# EAGLE design v03 (EAGLE 6.6.0)
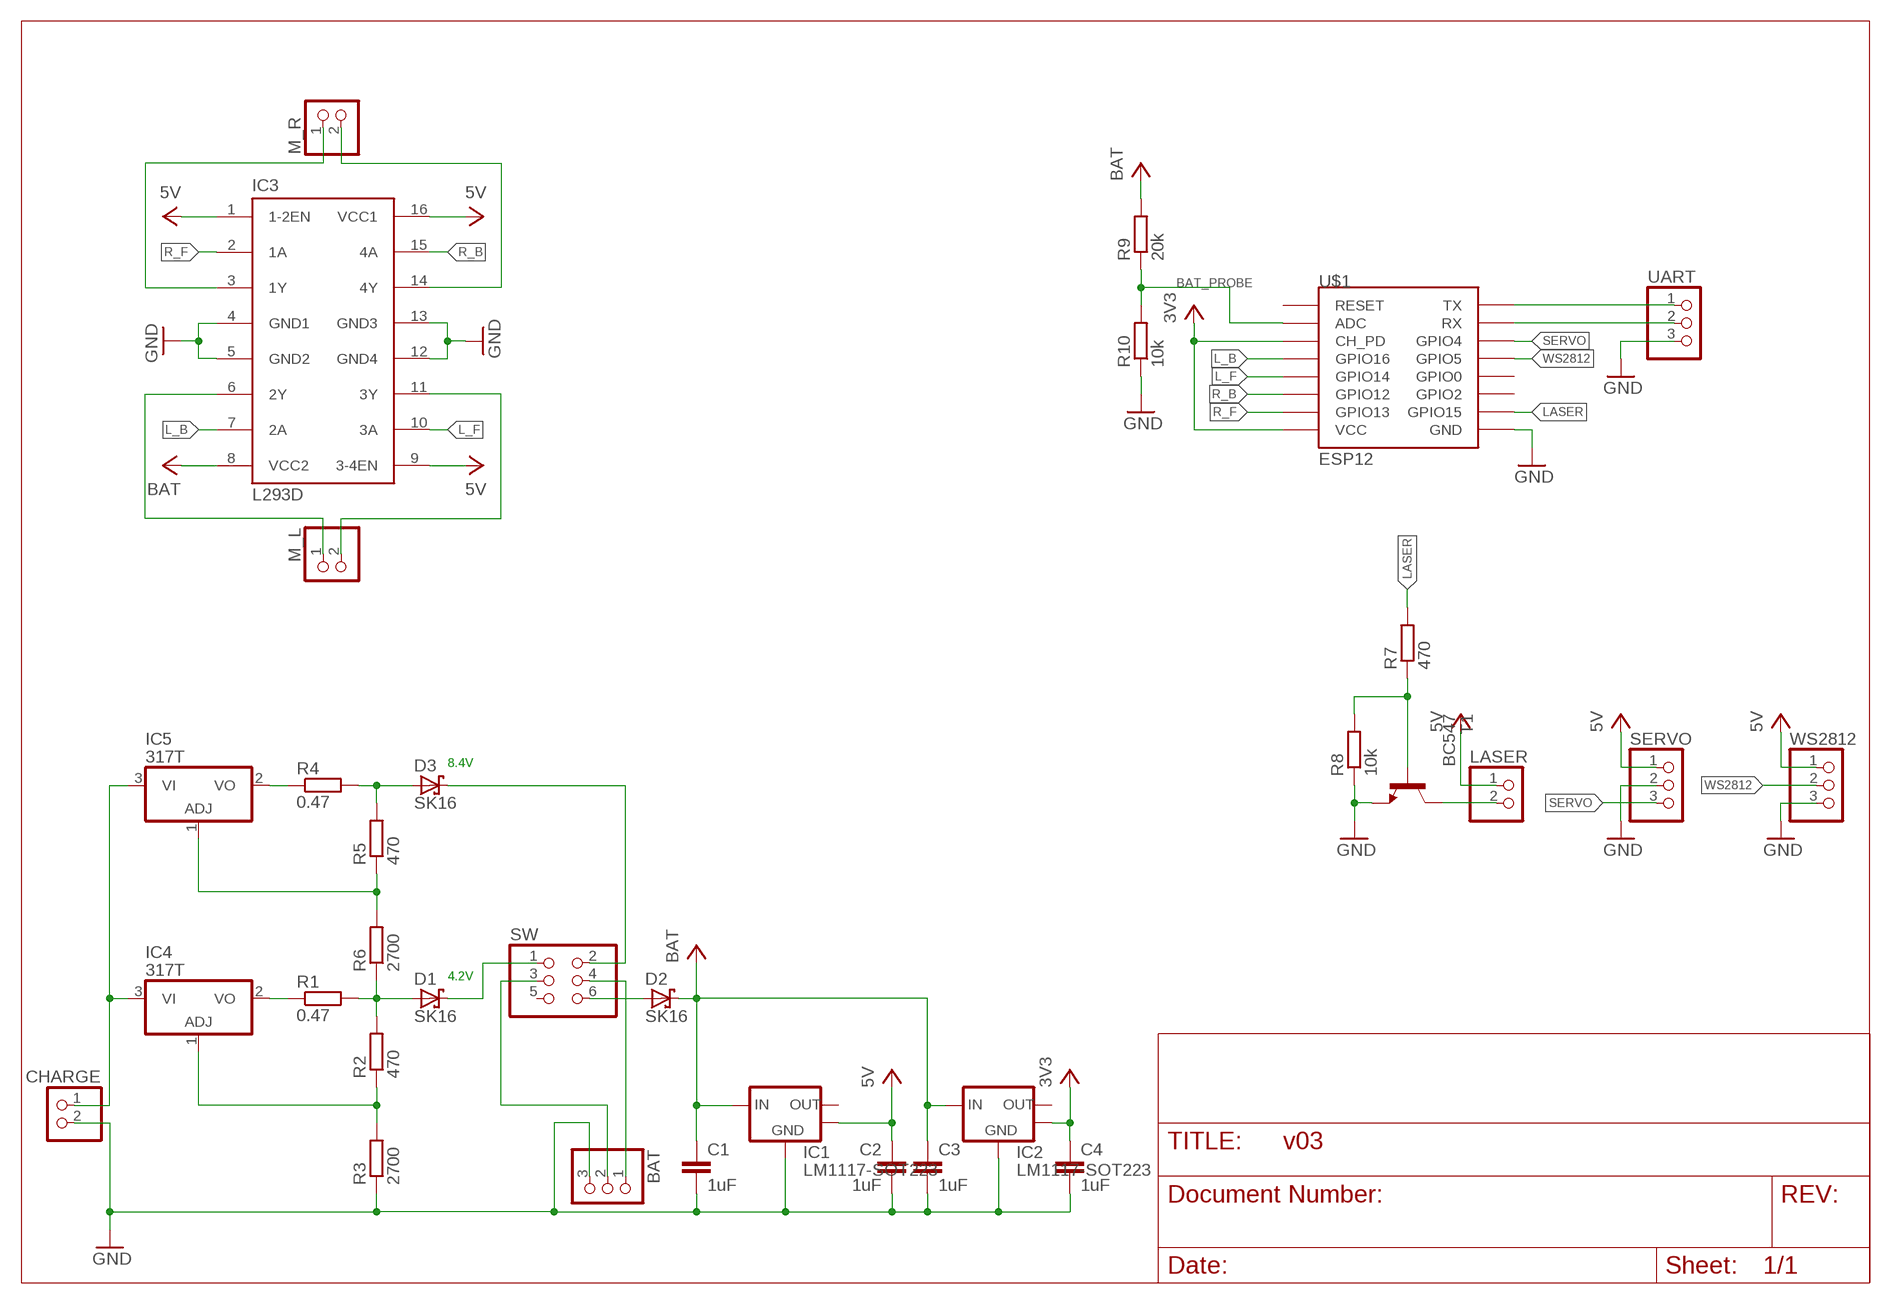
[diagram p0: schematic, sheet 1]

## Parts
BAT  PINHD-1X3  [1X03]
C1  1uF  C-EUC0805  [C0805]
C2  1uF  C-EUC0805  [C0805]
C3  1uF  C-EUC0805  [C0805]
C4  1uF  C-EUC0805  [C0805]
CHARGE  PINHD-1X2  [1X02]
D1  SK16  SCHOTTKY-DIODESMD  [SMB]
D2  SK16  SCHOTTKY-DIODESMD  [SMB]
D3  SK16  SCHOTTKY-DIODESMD  [SMB]
IC1  LM1117-SOT223  [SOT-223-3]
IC2  LM1117-SOT223  [SOT-223-3]
IC3  L293D  [DIL16]
IC4  317T  [TO220H]
IC5  317T  [TO220H]
LASER  PINHD-1X2  [1X02]
M_L  PINHD-1X2  [1X02]
M_R  PINHD-1X2  [1X02]
R1  0.47  R-EU_MELF0207W  [MINI_MELF-0207W]
R2  470  R-EU_R0805  [R0805]
R3  2700  R-EU_R0805  [R0805]
R4  0.47  R-EU_MELF0207W  [MINI_MELF-0207W]
R5  470  R-EU_R0805  [R0805]
R6  2700  R-EU_R0805  [R0805]
R7  470  R-EU_R0805  [R0805]
R8  10k  R-EU_R0805  [R0805]
R9  20k  R-EU_R0805  [R0805]
R10  10k  R-EU_R0805  [R0805]
SERVO  PINHD-1X3  [1X03]
SW  PINHD-2X3  [2X03]
T1  BC547  [TO92]
U$1  ESP12  [ESP12]
UART  PINHD-1X3  [1X03]
WS2812  PINHD-1X3  [1X03]

## Nets
3V3: C4.1 IC2.4(HEATSINK) U$1.CH_PD U$1.VCC
5V: C2.1 IC1.4(HEATSINK) IC3.1(1-2EN) IC3.9(3-4EN) IC3.16(VCC1) LASER.1 SERVO.1 WS2812.1
BAT: C1.1 C3.1 D2.C IC1.3(VIN) IC2.3(VIN) IC3.8(VCC2) R9.2
BAT_PROBE: R9.1 R10.2 U$1.ADC
GND: BAT.3 C1.2 C2.2 C3.2 C4.2 CHARGE.2 IC1.1(GND) IC2.1(GND) IC3.4(GND1) IC3.5(GND2) IC3.12(GND4) IC3.13(GND3) R3.1 R8.1 R10.1 SERVO.2 T1.1(E) U$1.GND UART.3 WS2812.3
L_B: IC3.7(2A) U$1.GPIO16
L_F: IC3.10(3A) U$1.GPIO14
LASER: R7.2 U$1.GPIO15
N$1: BAT.1 SW.4
N$3: CHARGE.1 IC4.3(VI) IC5.3(VI)
N$4: BAT.2 SW.3
N$5: IC3.3(1Y) M_R.1
N$6: IC3.14(4Y) M_R.2
N$7: IC3.6(2Y) M_L.1
N$8: IC3.11(3Y) M_L.2
N$9: U$1.TX UART.1
N$10: U$1.RX UART.2
N$11: LASER.2 T1.3(C)
N$12: D1.A R1.2 R2.2 R6.1
N$13: IC4.1(ADJ) R2.1 R3.2
N$14: IC4.2(VO) R1.1
N$16: D1.C SW.1
N$17: IC5.1(ADJ) R5.1 R6.2
N$18: IC5.2(VO) R4.1
N$19: D3.C SW.2
N$20: D3.A R4.2 R5.2
N$21: D2.A SW.6
R8: R7.1 R8.2 T1.2(B)
R_B: IC3.15(4A) U$1.GPIO12
R_F: IC3.2(1A) U$1.GPIO13
SERVO: SERVO.3 U$1.GPIO4
WS2812: U$1.GPIO5 WS2812.2
Unconnected: IC1.2(VOUT) IC2.2(VOUT) SW.5 U$1.GPIO0 U$1.GPIO2 U$1.RESET

## Notes on the sheet
- 8.4V
- 4.2V

## Library data of the parts
BAT SERVO UART WS2812 = pinhead:PINHD-1X3: PIN HEADER
C1-C4 = rcl:C-EU: CAPACITOR, European symbol
CHARGE LASER M_L M_R = pinhead:PINHD-1X2: PIN HEADER
D1-D3 = diode:SCHOTTKY-DIODE: Schottky Diode
IC1 IC2 = voltage_regulator:LM1117: LDO Voltage Regulator NCP1117 series are low dropout positive voltage regulators that are capable of providing an output current that is in excess of 1.0 A with a maximum dropout voltage of 1.2 V at 800 mA over temperature. This series contains nine fixed output voltages of 1.5 V, 1.8 V, 1.9 V, 2.0 V, 2.5 V, 2.85 V, 3.3 V, 5.0 V, and 12 V that have no minimum load requirement to maintain regulation. Also included is an adjustable output version that can be programmed from 1.25 V to 18.8 V with two external resistors. datasheet.pdf <http://www.onsemi.com/pub_link/Collateral/NCP1117-D.PDF> LM1117-N is a series of low dropout voltage regulators of 1.2V at 800mA of load current. It has the same pin-out as Texas Instruments' industry standard LM317. The LM1117-N is available in an adjustable version, available in five fixed voltages, 1.8V, 2.5V, 2.85V, 3.3V, and 5V. The LM1117-N offers current limiting and thermal shutdown. Its circuit includes a zener trimmed to within ±1%. datasheet.pdf <http://www.ti.com/lit/ds/symlink/lm1117-n.pdf>
IC3 = st-microelectronics:L293D: PUSH-PULL 4 CHANNEL DRIVER; MPN: L293D; OC_FARNELL: 9589619; OC_NEWARK: 56P8249
IC4 IC5 = linear:*317: Positive VOLTAGE REGULATOR
R1 R4 = resistor:R-EU_: RESISTOR, European symbol
R2 R3 R5-R10 = rcl:R-EU_: RESISTOR, European symbol
SW = pinhead:PINHD-2X3: PIN HEADER
T1 = transistor:BC547: NPN TRANSISTOR
U$1 = esp8266modules:ESP12: ESP8266 Wifi module 12

## Board
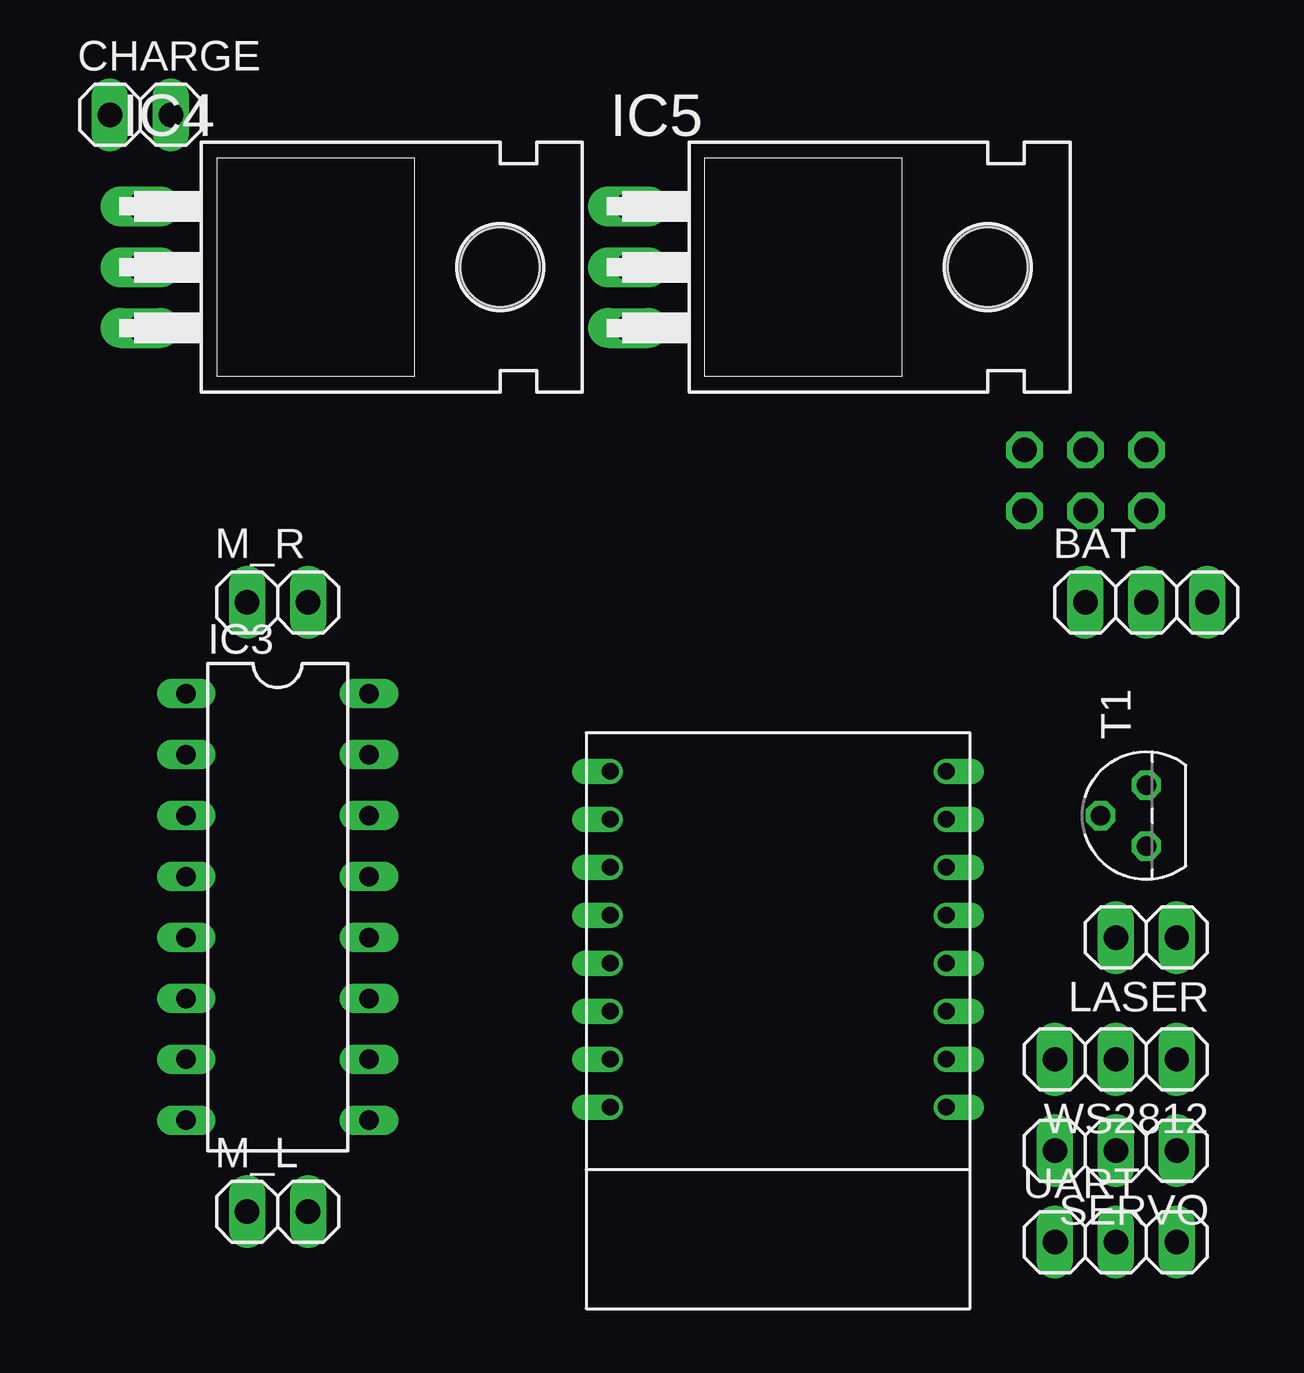
[diagram p1: board, top side]
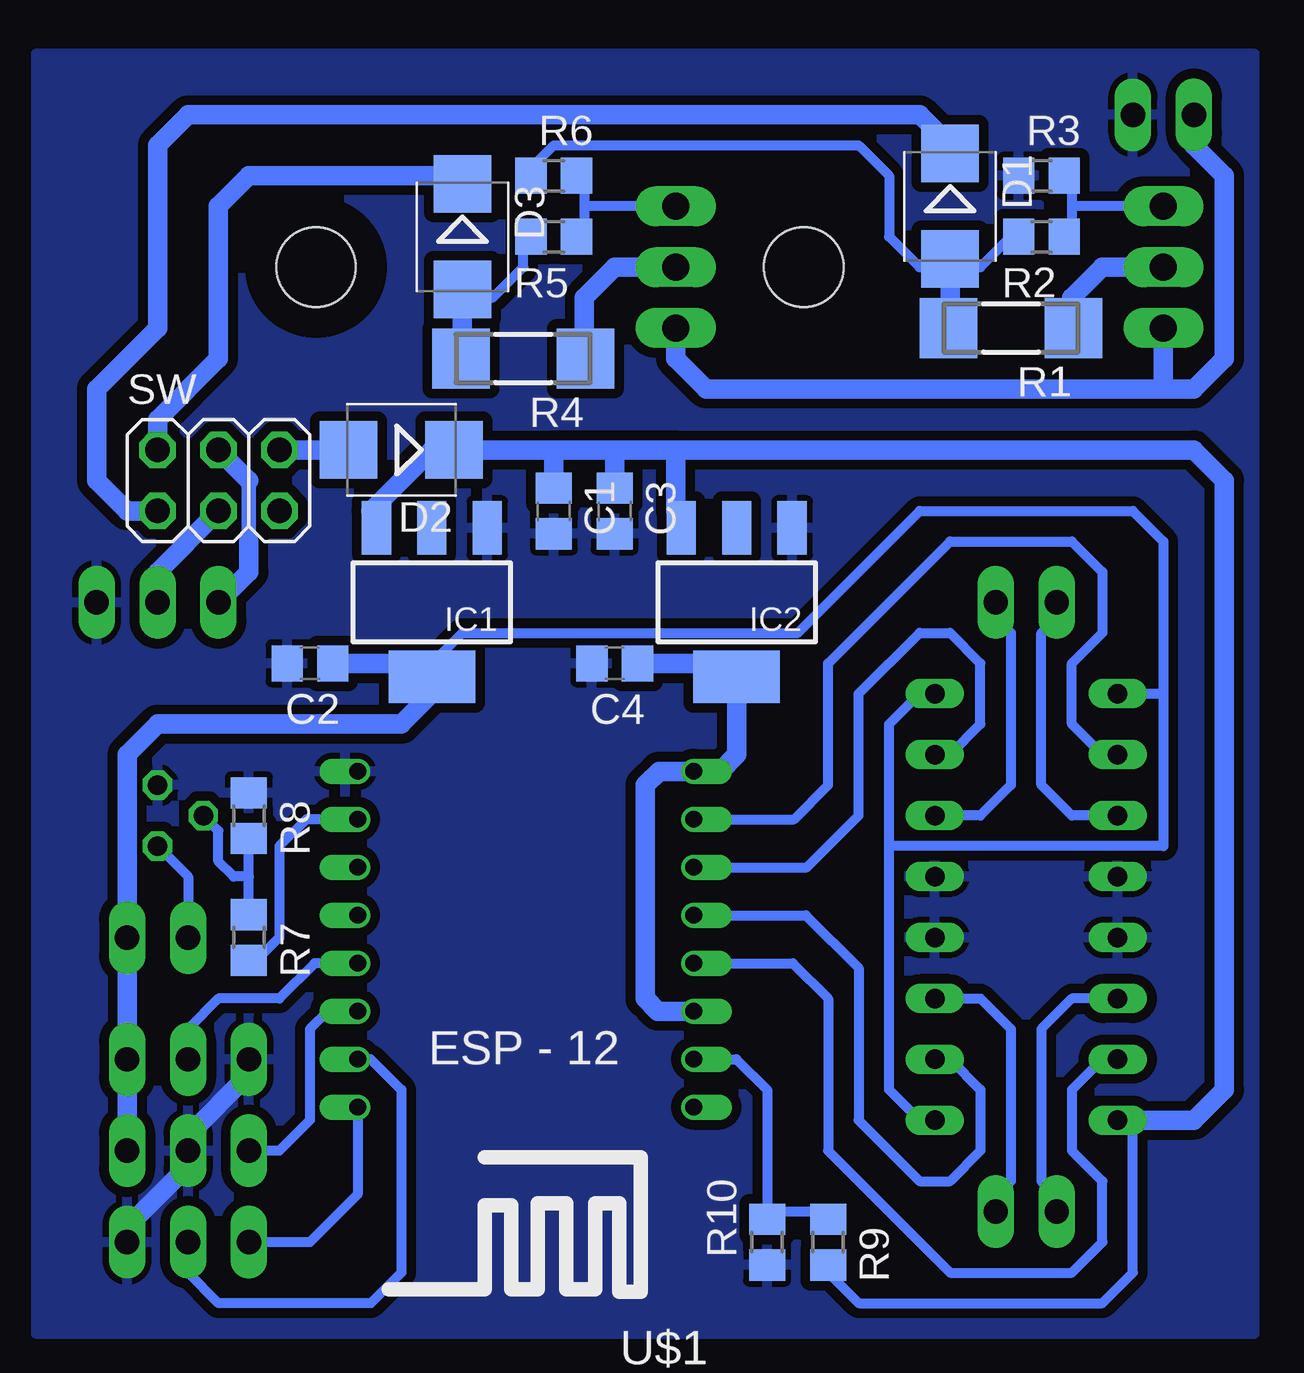
[diagram p2: board, bottom side, seen from below]

No outline drawn. Coordinates in mm, seen from the top.
Copper layers (1*16): Top 0.0356mm / dielectric 1.5011mm / Bottom 0.0356mm
Design rules "LaenPCBOrder": minimum track width 6mil, minimum drill 13mil, track to track 6mil, track to pad 6mil, pad to pad 6mil, via to via 6mil, smd to smd 6mil, copper to edge 15mil, drill to drill 6mil, minimum pad ring 7mil, minimum via ring 7mil, stop-mask expansion 3mil, vias tented up to drill 0mil, thermal gap 10mil

### Footprints (pad centres in the part's own frame; a part is rotated, then mirrored left to right if it is on the bottom)
1X03 = drill 1.016 long: 1 -2.54,0; 2 0,0; 3 2.54,0
C0805 = smd 1.3 x 1.5: 1 -0.95,0; 2 0.95,0
1X02 = drill 1.016 long: 1 -1.27,0; 2 1.27,0
SMB = smd 2.4 x 2.4: A 2.2,0; C -2.2,0
SOT-223-3 = smd 1.219 x 2.235: 1 -2.311,-3.099; 2 0,-3.099; 3 2.311,-3.099 | smd 3.6 x 2.2: 4 0,3.099
DIL16 = drill 0.813 long: 1 -8.89,-3.81; 2 -6.35,-3.81; 3 -3.81,-3.81; 4 -1.27,-3.81; 5 1.27,-3.81; 6 3.81,-3.81; 7 6.35,-3.81; 8 8.89,-3.81; 9 8.89,3.81; 10 6.35,3.81; 11 3.81,3.81; 12 1.27,3.81; 13 -1.27,3.81; 14 -3.81,3.81; 15 -6.35,3.81; 16 -8.89,3.81
TO220H = drill 1.118 long: 1 -2.54,-10.16; 2 0,-10.16; 3 2.54,-10.16 | hole 3.302: 0,4.826
MINI_MELF-0207W = smd 2.4 x 2.5: 1 -2.6,0; 2 2.6,0
R0805 = smd 1.3 x 1.5: 1 -0.95,0; 2 0.95,0
2X03 = drill 1.016 octagon: 1 -2.54,-1.27; 2 -2.54,1.27; 3 0,-1.27; 4 0,1.27; 5 2.54,-1.27; 6 2.54,1.27
TO92 = drill 0.813 octagon: 1 1.27,0; 2 0,1.905; 3 -1.27,0
ESP12 = drill 0.7 offset: ADC -7.1,3.8; CH_PD -7.1,1.8; GND 6.9,-8.2; GPIO0 6.9,-2.2; GPIO2 6.9,-4.2; GPIO4 6.9,1.8; GPIO5 6.9,-0.2; GPIO12 -7.1,-4.2; GPIO13 -7.1,-6.2; GPIO14 -7.1,-2.2; GPIO15 6.9,-6.2; GPIO16 -7.1,-0.2; RESET -7.1,5.8; RX 6.9,3.8; TX 6.9,5.8; VCC -7.1,-8.2

### Placement (x,y rotation side)
BAT  45.72,30.48 0 top
C1  29.21,34.29 270 bottom
C2  39.37,27.94 180 bottom
C3  26.67,34.29 270 bottom
C4  26.67,27.94 180 bottom
CHARGE  3.81,50.8 0 top
D1  12.7,46.99 270 bottom
D2  35.56,36.83 180 bottom
D3  33.02,45.72 270 bottom
IC1  34.29,30.48 180 bottom
IC2  21.59,30.48 180 bottom
IC3  9.53,17.78 270 top
IC4  13.97,44.45 270 top
IC5  34.29,44.45 270 top
LASER  45.72,16.51 180 top
M_L  9.53,5.08 0 top
M_R  9.53,30.48 0 top
R1  10.16,41.91 180 bottom
R2  8.89,45.72 180 bottom
R3  8.89,48.26 0 bottom
R4  30.48,40.64 180 bottom
R5  29.21,45.72 180 bottom
R6  29.21,48.26 0 bottom
R7  41.91,16.51 270 bottom
R8  41.91,21.59 270 bottom
R9  17.78,3.81 270 bottom
R10  20.32,3.81 90 bottom
SERVO  44.45,7.62 180 top
SW  43.18,35.56 0 bottom
T1  45.72,21.59 90 top
U$1  30.48,15.24 180 bottom
UART  44.45,3.81 0 top
WS2812  44.45,11.43 180 top

### Tracks (layer width: path | path; a pad name or v marks a point on that pad's centre or on a via)
3V3
  Bottom 0.813: 21.59,26.67 21.59,24.13 22.28,23.44 U$1.VCC 24.82,23.44 25.4,22.86 25.4,13.97 24.87,13.44 U$1.CH_PD | 21.59,26.67 IC2.4 | C4.1 22.86,27.94 21.59,26.67
5V
  Bottom 0.406: 15.24,20.32 3.81,20.32 3.81,26.67 | 15.24,20.32 15.24,25.4 13.97,26.67 IC3.16 | IC3.9 13.97,8.89 15.24,10.16 15.24,20.32 | 3.81,26.67 3.81,33.02 5.08,34.29 13.97,34.29 19.05,29.21 33.02,29.21 34.29,27.94 IC1.4 | IC3.1 3.81,26.67
  Bottom 0.813: SERVO.1 WS2812.1 LASER.1 46.99,24.13 45.72,25.4 35.56,25.4 34.29,26.67 34.29,27.94 C2.1
BAT
  Bottom 0.406: R9.2 17.78,2.54 16.51,1.27 6.35,1.27 5.08,2.54 5.08,8.89 2.54,8.89
  Bottom 0.813: 24.13,36.83 2.54,36.83 1.27,35.56 1.27,10.16 2.54,8.89 IC3.8 | IC2.3 23.9,34.06 24.13,34.29 24.13,36.83 | 29.21,36.83 D2.C 34.29,36.83 36.83,34.29 36.6,34.06 IC1.3 | 26.67,36.83 29.21,36.83 | C3.1 26.67,36.83 | C1.1 29.21,36.83 | 24.13,36.83 26.67,36.83
BAT_PROBE
  Bottom 0.406: R9.1 17.78,5.08 20.32,5.08 | U$1.ADC 21.6,11.44 20.32,10.16 20.32,5.08 | 20.32,5.08 R10.2
GND
  Bottom 0.813: UART.3 46.99,4.45 44.45,6.99 SERVO.2 44.45,8.26 41.91,10.79 WS2812.3
  pour Bottom (isolate 0.406): 0,0 0,53.34 50.8,53.34 50.8,0
L_B
  Bottom 0.406: IC3.7 6.35,11.43 7.62,10.16 7.62,7.62 6.35,6.35 6.35,3.81 7.62,2.54 12.7,2.54 17.78,7.62 17.78,13.97 19.25,15.44 U$1.GPIO16
L_F
  Bottom 0.406: IC3.10 12.7,11.43 11.43,10.16 11.43,7.62 12.7,6.35 13.97,6.35 16.51,8.89 16.51,15.24 18.71,17.44 U$1.GPIO14
LASER
  Bottom 0.406: U$1.GPIO15 39.52,21.44 40.64,20.32 40.64,16.51 41.91,15.24 R7.2
N$1
  Bottom 0.61: 41.91,33.02 41.91,35.56
  Bottom 0.813: BAT.1 41.91,31.75 41.91,33.02 | 41.91,35.56 SW.4
N$3
  Bottom 0.813: CHARGE.1 2.54,49.53 1.27,48.26 1.27,40.64 2.54,39.37 3.81,39.37 | IC4.3 3.81,39.37 | 3.81,39.37 22.86,39.37 24.13,40.64 IC5.3
N$4
  Bottom 0.813: BAT.2 45.72,31.75 SW.3
N$5
  Bottom 0.406: IC3.3 7.62,21.59 8.89,22.86 8.89,29.21 8.26,29.84 M_R.1
N$6
  Bottom 0.406: M_R.2 10.79,29.84 10.16,29.21 10.16,22.86 11.43,21.59 IC3.14
N$7
  Bottom 0.406: IC3.6 7.62,13.97 8.89,12.7 8.89,6.35 8.26,5.71 M_L.1
N$8
  Bottom 0.406: IC3.11 11.43,13.97 10.16,12.7 10.16,6.35 10.79,5.71 M_L.2
N$9
  Bottom 0.406: UART.1 39.37,3.81 37.38,5.8 U$1.TX
N$10
  Bottom 0.406: U$1.RX 36.84,11.44 35.56,10.16 35.56,2.54 36.83,1.27 43.18,1.27 44.45,2.54 UART.2
N$11
  Bottom 0.406: T1.3 44.45,19.05 LASER.2
N$12
  Bottom 0.406: R2.2 10.16,45.72 11.43,44.45 12.7,44.45 13.97,44.45 15.24,45.72 15.24,48.26 16.51,49.53 29.21,49.53 30.48,48.26 R6.1
  Bottom 0.813: R1.2 12.7,41.91 12.7,44.45 D1.A
N$13
  Bottom 0.406: IC4.1 7.62,46.99 | 7.62,46.99 7.62,45.72 R2.1 | R3.2 7.62,48.26 7.62,46.99
N$14
  Bottom 0.813: R1.1 7.62,41.91 7.62,43.18 6.35,44.45 IC4.2
N$16
  Bottom 0.813: D1.C 12.7,49.53 13.97,50.8 44.45,50.8 45.72,49.53 45.72,41.91 48.26,39.37 48.26,35.56 46.99,34.29 SW.1
N$17
  Bottom 0.406: IC5.1 27.94,46.99 | 27.94,46.99 27.94,45.72 R5.1 | R6.2 27.94,48.26 27.94,46.99
N$18
  Bottom 0.813: IC5.2 26.67,44.45 27.94,43.18 27.94,40.64 R4.1
N$19
  Bottom 0.813: D3.C 33.02,48.26 41.91,48.26 43.18,46.99 43.18,40.64 45.72,38.1 SW.2
N$20
  Bottom 0.406: 33.02,43.18 31.75,43.18 30.48,44.45 30.48,45.72 R5.2
  Bottom 0.813: R4.2 33.02,40.64 33.02,43.18 D3.A
N$21
  Bottom 0.813: 39.37,36.83 D2.A SW.6
R8
  Bottom 0.406: 41.91,19.05 42.55,19.05 43.18,19.68 43.18,20.95 T1.2 | R7.1 41.91,19.05 | 41.91,19.05 R8.2
R_B
  Bottom 0.406: IC3.15 12.7,24.13 11.43,25.4 11.43,27.94 12.7,29.21 13.97,29.21 16.51,26.67 16.51,21.59 18.66,19.44 U$1.GPIO12
R_F
  Bottom 0.406: IC3.2 6.35,24.13 7.62,25.4 7.62,27.94 6.35,29.21 6.35,31.75 7.62,33.02 12.7,33.02 17.78,27.94 17.78,22.86 19.2,21.44 U$1.GPIO13
SERVO
  Bottom 0.406: U$1.GPIO4 38.63,13.44 39.37,12.7 39.37,8.89 40.64,7.62 SERVO.3
WS2812
  Bottom 0.406: WS2812.2 44.45,12.7 43.18,13.97 40.64,13.97 39.17,15.44 U$1.GPIO5